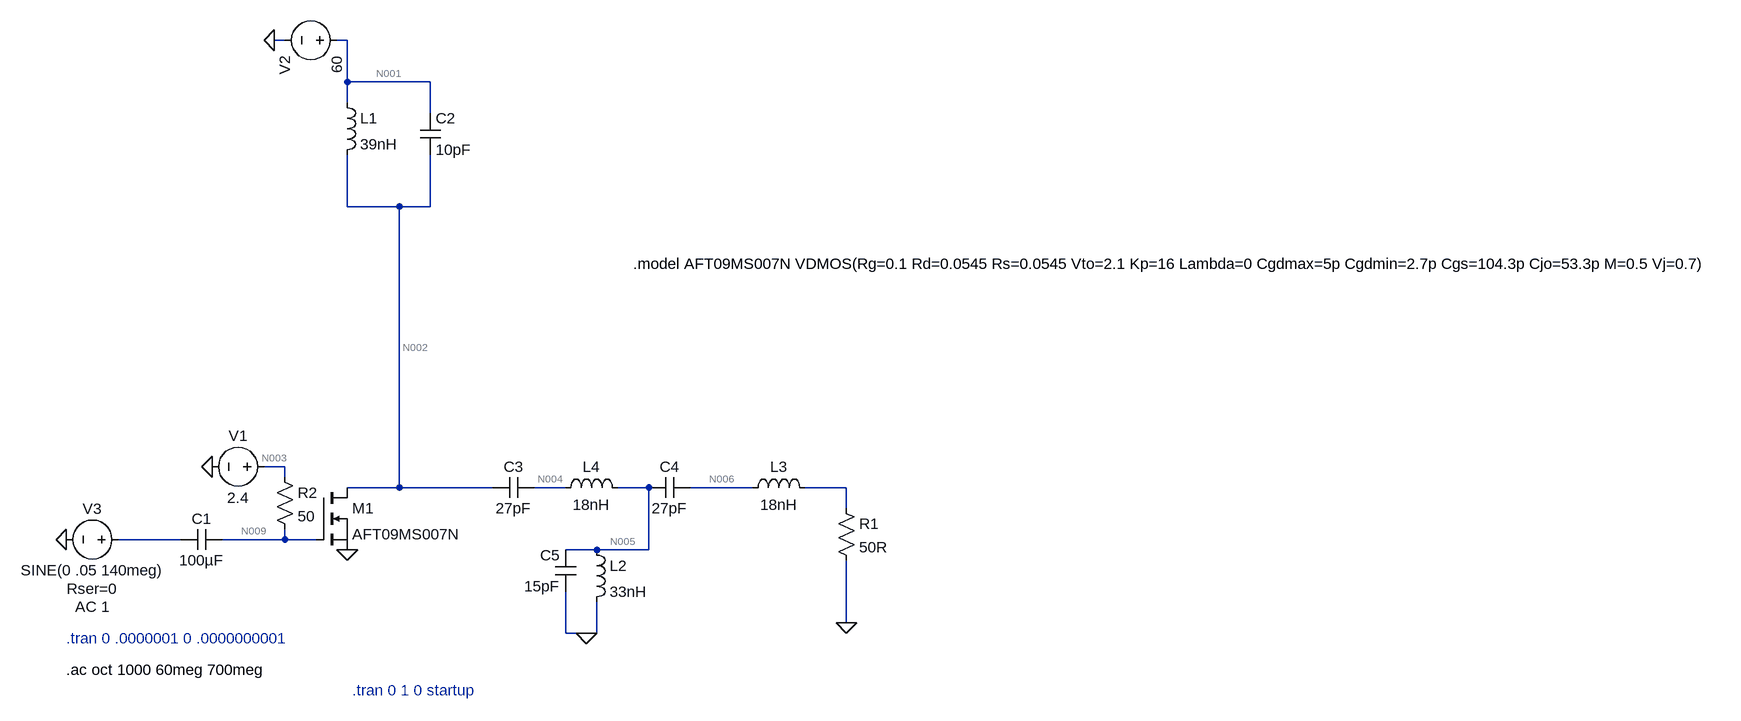
[diagram p0: schematic MOSFET RF front end amplifier.asc]
MOSFET RF front end amplifier.asc, the LTspice schematic file:
Version 4.1
SHEET 1 4972 680
WIRE 144 -352 128 -352
WIRE 240 -352 224 -352
WIRE 240 -288 240 -352
WIRE 368 -288 240 -288
WIRE 240 -256 240 -288
WIRE 368 -240 368 -288
WIRE 240 -96 240 -176
WIRE 320 -96 240 -96
WIRE 368 -96 368 -176
WIRE 368 -96 320 -96
WIRE 144 304 112 304
WIRE 144 320 144 304
WIRE 320 336 320 -96
WIRE 320 336 240 336
WIRE 464 336 320 336
WIRE 576 336 528 336
WIRE 704 336 656 336
WIRE 864 336 768 336
WIRE 1008 336 944 336
WIRE 1008 368 1008 336
WIRE -16 416 -112 416
WIRE 144 416 144 400
WIRE 144 416 48 416
WIRE 192 416 144 416
WIRE 624 432 576 432
WIRE 704 432 704 336
WIRE 704 432 624 432
WIRE 1008 544 1008 448
WIRE 576 560 576 496
WIRE 608 560 576 560
WIRE 624 560 624 512
WIRE 624 560 608 560
FLAG 1008 544 0
FLAG 32 304 0
FLAG 240 432 0
FLAG -192 416 0
FLAG 128 -352 0
FLAG 608 560 0
SYMBOL nmos 192 336 R0
SYMATTR InstName M1
SYMATTR Value AFT09MS007N
SYMBOL voltage 240 -352 R90
WINDOW 0 24 96 Left 2
WINDOW 3 24 16 Left 2
WINDOW 123 0 0 Left 0
WINDOW 39 0 0 Left 0
SYMATTR InstName V2
SYMATTR Value 60
SYMBOL cap -16 400 M90
WINDOW 0 0 32 VBottom 2
WINDOW 3 32 32 VTop 2
SYMATTR InstName C1
SYMATTR Value 100µF
SYMBOL res 992 352 R0
SYMATTR InstName R1
SYMATTR Value 50R
SYMBOL voltage 128 304 R90
WINDOW 0 -32 56 VBottom 2
WINDOW 3 32 56 VTop 2
WINDOW 123 0 0 Left 0
WINDOW 39 0 0 Left 0
SYMATTR InstName V1
SYMATTR Value 2.4
SYMBOL res 128 304 R0
SYMATTR InstName R2
SYMATTR Value 50
SYMBOL voltage -96 416 R90
WINDOW 0 -32 56 VBottom 2
WINDOW 3 32 56 VTop 2
WINDOW 123 88 56 VTop 2
WINDOW 39 60 56 VTop 2
SYMATTR InstName V3
SYMATTR Value SINE(0 .05 140meg)
SYMATTR Value2 AC 1
SYMATTR SpiceLine Rser=0
SYMBOL ind 224 -272 R0
SYMATTR InstName L1
SYMATTR Value 39nH
SYMBOL cap 352 -240 R0
SYMATTR InstName C2
SYMATTR Value 10pF
SYMBOL cap 528 320 R90
WINDOW 0 0 32 VBottom 2
WINDOW 3 32 32 VTop 2
SYMATTR InstName C3
SYMATTR Value 27pF
SYMBOL cap 768 320 R90
WINDOW 0 0 32 VBottom 2
WINDOW 3 32 32 VTop 2
SYMATTR InstName C4
SYMATTR Value 27pF
SYMBOL cap 592 496 R180
WINDOW 0 24 56 Left 2
WINDOW 3 24 8 Left 2
SYMATTR InstName C5
SYMATTR Value 15pF
SYMBOL ind 608 416 R0
SYMATTR InstName L2
SYMATTR Value 33nH
SYMBOL ind 848 352 R270
WINDOW 0 32 56 VTop 2
WINDOW 3 5 56 VBottom 2
SYMATTR InstName L3
SYMATTR Value 18nH
SYMBOL ind 560 352 R270
WINDOW 0 32 56 VTop 2
WINDOW 3 5 56 VBottom 2
SYMATTR InstName L4
SYMATTR Value 18nH
TEXT -192 568 Left 2 ;.tran 0 .0000001 0 .0000000001
TEXT 680 -8 Left 2 !.model AFT09MS007N VDMOS(Rg=0.1 Rd=0.0545 Rs=0.0545 Vto=2.1 Kp=16 Lambda=0 Cgdmax=5p Cgdmin=2.7p Cgs=104.3p Cjo=53.3p M=0.5 Vj=0.7)
TEXT -192 616 Left 2 !.ac oct 1000 60meg 700meg
TEXT 248 648 Left 2 ;.tran 0 1 0 startup

The netlist it stands for:
* MOSFET RF front end amplifier.asc
M1 N002 N009 0 0 AFT09MS007N
V2 N001 0 60
C1 N008 N009 100µF
R1 N007 0 50R
V1 N003 0 2.4
R2 N003 N009 50
V3 N008 0 SINE(0 .05 140meg) AC 1 Rser=0
L1 N001 N002 39nH
C2 N001 N002 10pF
C3 N004 N002 27pF
C4 N006 N005 27pF
C5 0 N005 15pF
L2 N005 0 33nH
L3 N006 N007 18nH
L4 N004 N005 18nH
.model NMOS NMOS
.model PMOS PMOS
.lib standard.mos
* .tran 0 .0000001 0 .0000000001
.model AFT09MS007N VDMOS(Rg=0.1 Rd=0.0545 Rs=0.0545 Vto=2.1 Kp=16 Lambda=0 Cgdmax=5p Cgdmin=2.7p Cgs=104.3p Cjo=53.3p M=0.5 Vj=0.7)
.ac oct 1000 60meg 700meg
* .tran 0 1 0 startup
.backanno
.end

* Results of the author's LTspice run, read from the files saved beside the schematic
* Operating Point, zero values left out:
*   V(n009) = 2.4 V
*   V(n002) = 60 V
*   V(n001) = 60 V
*   V(n003) = 2.4 V
*   Id(M1) = 577 mA
*   Ig(M1) = -2.716 pA
*   Is(M1) = -577 mA
*   I(L1) = 577 mA
*   I(V2) = -577 mA
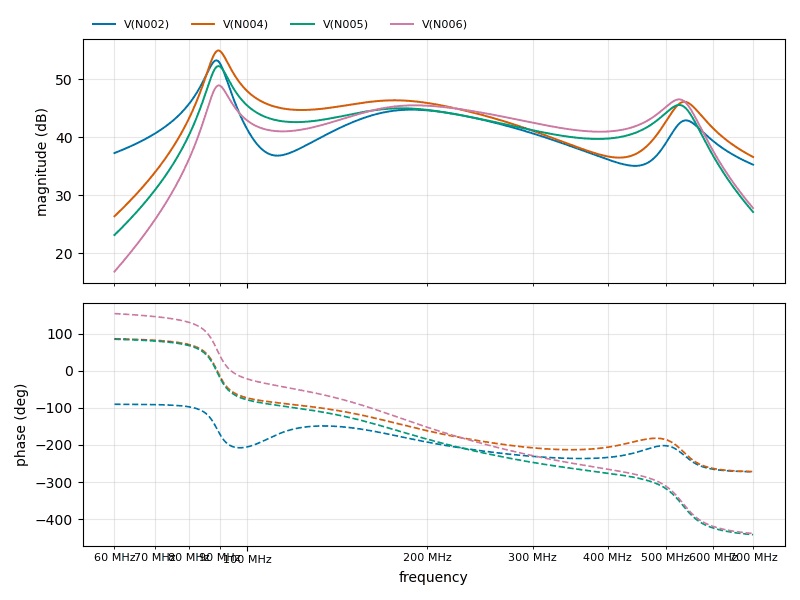
[diagram p1: AC Analysis of MOSFET RF front end amplifier.asc, plotted from the saved traces]
* AC Analysis, 1 run:
*   V(N002): 37.28 dB at 60 MHz, 35.28 dB at 700 MHz, peak 53.26 dB at 88.76 MHz, 3 dB below the peak at 84.95 MHz and 92.15 MHz
*   V(N004): 26.39 dB at 60 MHz, 36.60 dB at 700 MHz, peak 54.95 dB at 89.5 MHz, 3 dB below the peak at 86.23 MHz and 93.73 MHz
*   V(N005): 23.16 dB at 60 MHz, 27.12 dB at 700 MHz, peak 52.27 dB at 89.5 MHz, 3 dB below the peak at 86.27 MHz and 93.82 MHz
*   V(N006): 16.86 dB at 60 MHz, 27.80 dB at 700 MHz, peak 48.94 dB at 89.63 MHz, 3 dB below the peak at 86.44 MHz and 94.24 MHz